# EAGLE design shield (EAGLE 9.6.1)

## Sheet 1 of 2
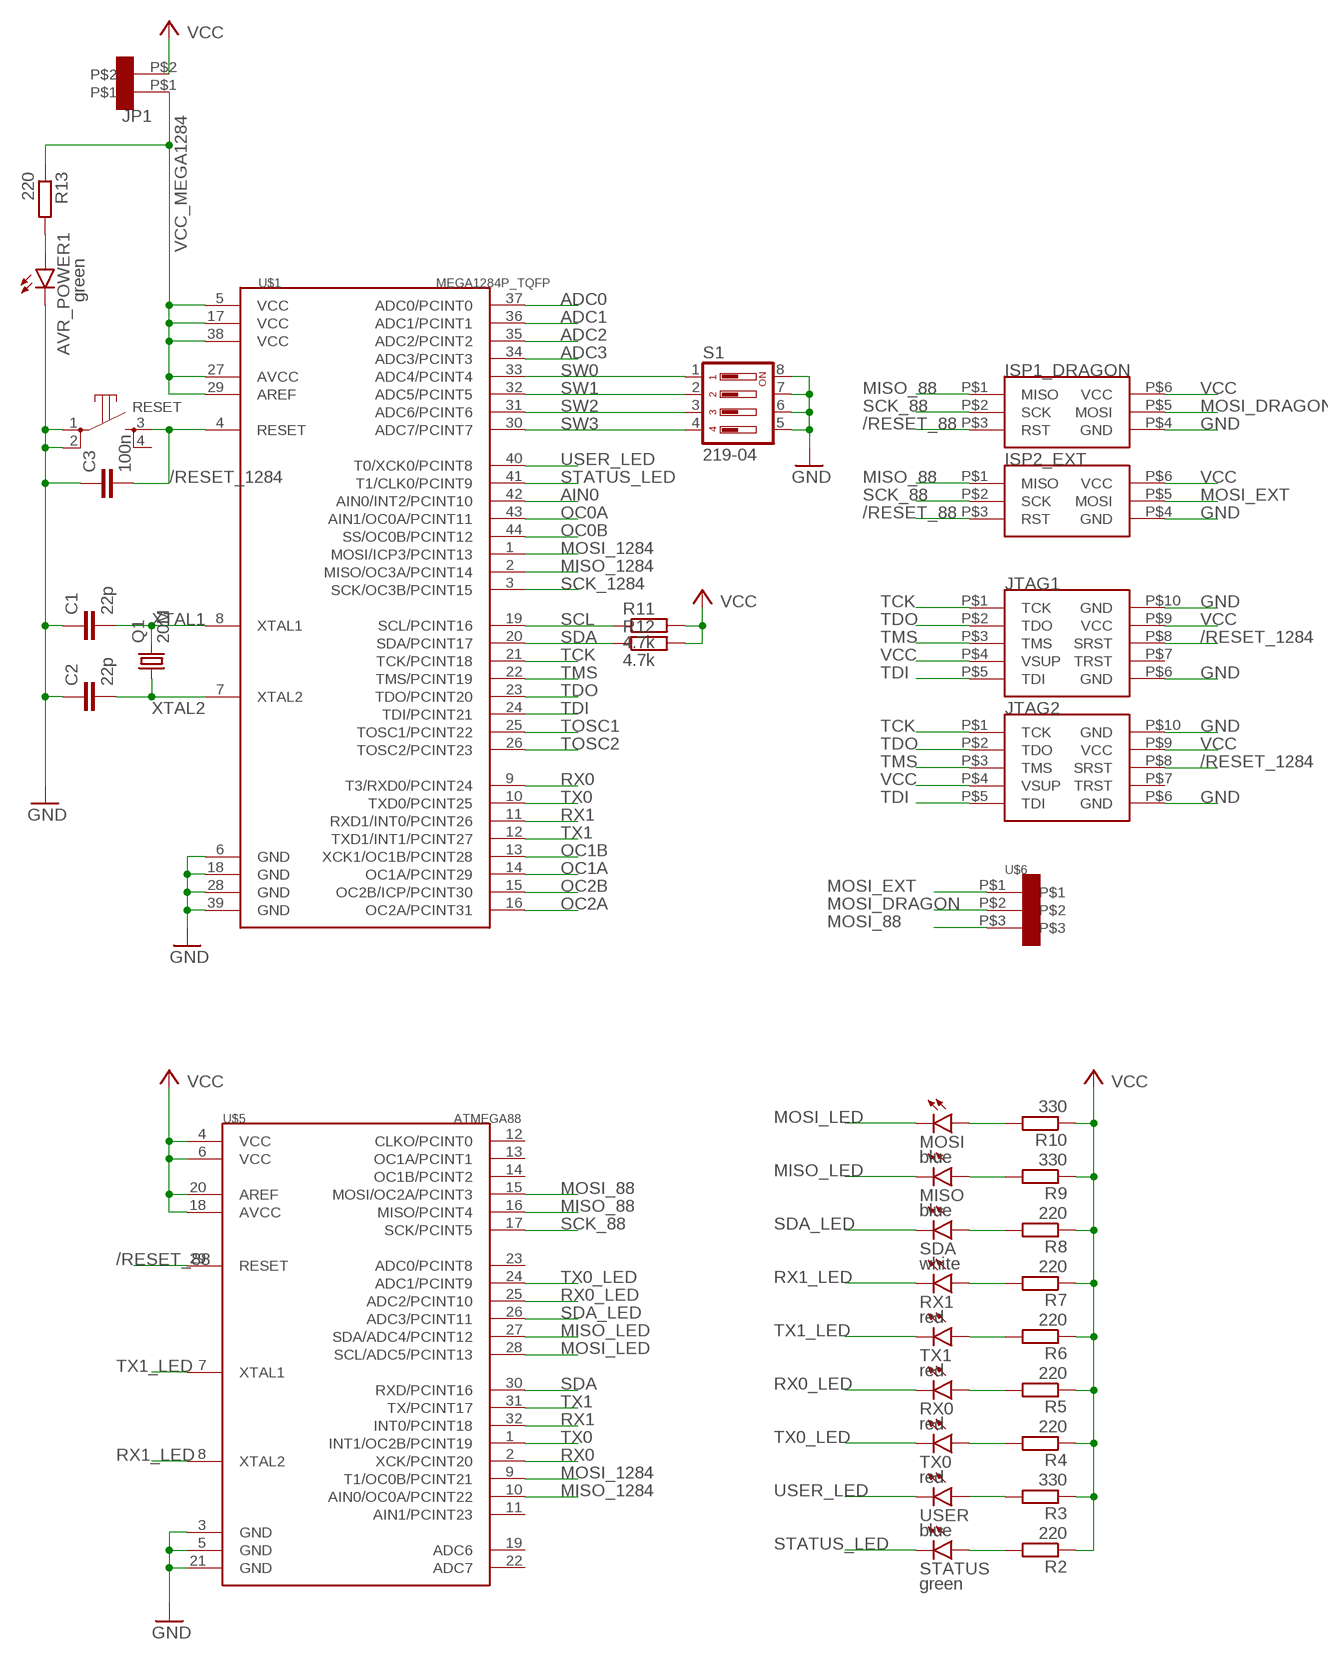
[diagram p0: schematic, sheet 1]

### Parts
AVR_POWER1  green  LEDCHIP-LED0603  [CHIP-LED0603]
C1  22p  C-EUC0603  [C0603]
C2  22p  C-EUC0603  [C0603]
C3  100n  C-EUC0603  [C0603]
ISP1_DRAGON  ISP  [CON_DIL_2X3]
ISP2_EXT  ISP  [CON_DIL_2X3]
JP1  CON_DIL_2  [CON_DIL_2]
JTAG1  JTAG  [CON_DIL_2X5]
JTAG2  JTAG  [CON_DIL_2X5]
MISO  blue  LEDCHIP-LED0603  [CHIP-LED0603]
MOSI  blue  LEDCHIP-LED0603  [CHIP-LED0603]
Q1  20M  CRYSTALHC49U-V  [HC49U-V]
R2  220  R-EU_R0603  [R0603]
R3  330  R-EU_R0603  [R0603]
R4  220  R-EU_R0603  [R0603]
R5  220  R-EU_R0603  [R0603]
R6  220  R-EU_R0603  [R0603]
R7  220  R-EU_R0603  [R0603]
R8  220  R-EU_R0603  [R0603]
R9  330  R-EU_R0603  [R0603]
R10  330  R-EU_R0603  [R0603]
R11  4.7k  R-EU_R0603  [R0603]
R12  4.7k  R-EU_R0603  [R0603]
R13  220  R-EU_R0603  [R0603]
RESET  4-1437565-2  [B3S-10XX]
RX0  red  LEDCHIP-LED0603  [CHIP-LED0603]
RX1  red  LEDCHIP-LED0603  [CHIP-LED0603]
S1  219-04  [CTS-219-04]
SDA  white  LEDCHIP-LED0603  [CHIP-LED0603]
STATUS  green  LEDCHIP-LED0603  [CHIP-LED0603]
TX0  red  LEDCHIP-LED0603  [CHIP-LED0603]
TX1  red  LEDCHIP-LED0603  [CHIP-LED0603]
U$1  MEGA1284P_TQFP  [TQFP44]
U$5  ATMEGA88  [TQFP32-08]
U$6  CON_DIL_3  [CON_DIL_3]
USER  blue  LEDCHIP-LED0603  [CHIP-LED0603]

### Nets
/RESET_88: ISP1_DRAGON.P$3(RST) ISP2_EXT.P$3(RST) U$5.29(RESET)
/RESET_1284: C3.2 JTAG1.P$8(SRST) JTAG2.P$8(SRST) RESET.3 U$1.4(RESET) ; also sheet 2
ADC0: U$1.37(ADC0/PCINT0) ; also sheet 2
ADC1: U$1.36(ADC1/PCINT1) ; also sheet 2
ADC2: U$1.35(ADC2/PCINT2) ; also sheet 2
ADC3: U$1.34(ADC3/PCINT3) ; also sheet 2
AIN0: U$1.42(AIN0/INT2/PCINT10) ; also sheet 2
GND: AVR_POWER1.C C1.1 C2.1 C3.1 ISP1_DRAGON.P$4(GND) ISP2_EXT.P$4(GND) JTAG1.P$6(GND) JTAG1.P$10(GND) JTAG2.P$6(GND) JTAG2.P$10(GND) RESET.1 RESET.2 S1.5 S1.6 S1.7 S1.8 U$1.6(GND) U$1.18(GND) U$1.28(GND) U$1.39(GND) U$5.3(GND) U$5.5(GND) U$5.21(GND) ; also sheet 2
MISO_88: ISP1_DRAGON.P$1(MISO) ISP2_EXT.P$1(MISO) U$5.16(MISO/PCINT4)
MISO_1284: U$1.2(MISO/OC3A/PCINT14) U$5.10(AIN0/OC0A/PCINT22) ; also sheet 2
MISO_LED: MISO.C U$5.27(SDA/ADC4/PCINT12)
MOSI_88: U$5.15(MOSI/OC2A/PCINT3) U$6.P$3
MOSI_1284: U$1.1(MOSI/ICP3/PCINT13) U$5.9(T1/OC0B/PCINT21) ; also sheet 2
MOSI_DRAGON: ISP1_DRAGON.P$5(MOSI) U$6.P$2
MOSI_EXT: ISP2_EXT.P$5(MOSI) U$6.P$1
MOSI_LED: MOSI.C U$5.28(SCL/ADC5/PCINT13)
N$2: R2.2 STATUS.A
N$3: R4.2 TX0.A
N$4: R5.2 RX0.A
N$5: R6.2 TX1.A
N$6: R7.2 RX1.A
N$7: R8.2 SDA.A
N$8: R3.2 USER.A
N$14: MISO.A R9.2
N$15: MOSI.A R10.2
N$52: AVR_POWER1.A R13.2
OC0A: U$1.43(AIN1/OC0A/PCINT11) ; also sheet 2
OC0B: U$1.44(SS/OC0B/PCINT12) ; also sheet 2
OC1A: U$1.14(OC1A/PCINT29) ; also sheet 2
OC1B: U$1.13(XCK1/OC1B/PCINT28) ; also sheet 2
OC2A: U$1.16(OC2A/PCINT31) ; also sheet 2
OC2B: U$1.15(OC2B/ICP/PCINT30) ; also sheet 2
RX0: U$1.9(T3/RXD0/PCINT24) U$5.2(XCK/PCINT20) ; also sheet 2
RX0_LED: RX0.C U$5.25(ADC2/PCINT10)
RX1: U$1.11(RXD1/INT0/PCINT26) U$5.32(INT0/PCINT18) ; also sheet 2
RX1_LED: RX1.C U$5.8(XTAL2)
SCK_88: ISP1_DRAGON.P$2(SCK) ISP2_EXT.P$2(SCK) U$5.17(SCK/PCINT5)
SCK_1284: U$1.3(SCK/OC3B/PCINT15) ; also sheet 2
SCL: R11.1 U$1.19(SCL/PCINT16) ; also sheet 2
SDA: R12.1 U$1.20(SDA/PCINT17) U$5.30(RXD/PCINT16) ; also sheet 2
SDA_LED: SDA.C U$5.26(ADC3/PCINT11)
STATUS_LED: STATUS.C U$1.41(T1/CLK0/PCINT9) ; also sheet 2
SW0: S1.1 U$1.33(ADC4/PCINT4) ; also sheet 2
SW1: S1.2 U$1.32(ADC5/PCINT5) ; also sheet 2
SW2: S1.3 U$1.31(ADC6/PCINT6) ; also sheet 2
SW3: S1.4 U$1.30(ADC7/PCINT7) ; also sheet 2
TCK: JTAG1.P$1(TCK) JTAG2.P$1(TCK) U$1.21(TCK/PCINT18) ; also sheet 2
TDI: JTAG1.P$5(TDI) JTAG2.P$5(TDI) U$1.24(TDI/PCINT21) ; also sheet 2
TDO: JTAG1.P$2(TDO) JTAG2.P$2(TDO) U$1.23(TDO/PCINT20) ; also sheet 2
TMS: JTAG1.P$3(TMS) JTAG2.P$3(TMS) U$1.22(TMS/PCINT19) ; also sheet 2
TOSC1: U$1.25(TOSC1/PCINT22) ; also sheet 2
TOSC2: U$1.26(TOSC2/PCINT23) ; also sheet 2
TX0: U$1.10(TXD0/PCINT25) U$5.1(INT1/OC2B/PCINT19) ; also sheet 2
TX0_LED: TX0.C U$5.24(ADC1/PCINT9)
TX1: U$1.12(TXD1/INT1/PCINT27) U$5.31(TX/PCINT17) ; also sheet 2
TX1_LED: TX1.C U$5.7(XTAL1)
USER_LED: U$1.40(T0/XCK0/PCINT8) USER.C ; also sheet 2
VCC: ISP1_DRAGON.P$6(VCC) ISP2_EXT.P$6(VCC) JP1.P$2 JTAG1.P$4(VSUP) JTAG1.P$9(VCC) JTAG2.P$4(VSUP) JTAG2.P$9(VCC) R2.1 R3.1 R4.1 R5.1 R6.1 R7.1 R8.1 R9.1 R10.1 R11.2 R12.2 U$5.4(VCC) U$5.6(VCC) U$5.18(AVCC) U$5.20(AREF) ; also sheet 2
VCC_MEGA1284: JP1.P$1 R13.1 U$1.5(VCC) U$1.17(VCC) U$1.27(AVCC) U$1.29(AREF) U$1.38(VCC) ; also sheet 2
XTAL1: C1.2 Q1.2 U$1.8(XTAL1) ; also sheet 2
XTAL2: C2.2 Q1.1 U$1.7(XTAL2) ; also sheet 2
Unconnected: JTAG1.P$7(TRST) JTAG2.P$7(TRST) RESET.4 U$5.11(AIN1/PCINT23) U$5.12(CLKO/PCINT0) U$5.13(OC1A/PCINT1) U$5.14(OC1B/PCINT2) U$5.19(ADC6) U$5.22(ADC7) U$5.23(ADC0/PCINT8)

## Sheet 2 of 2
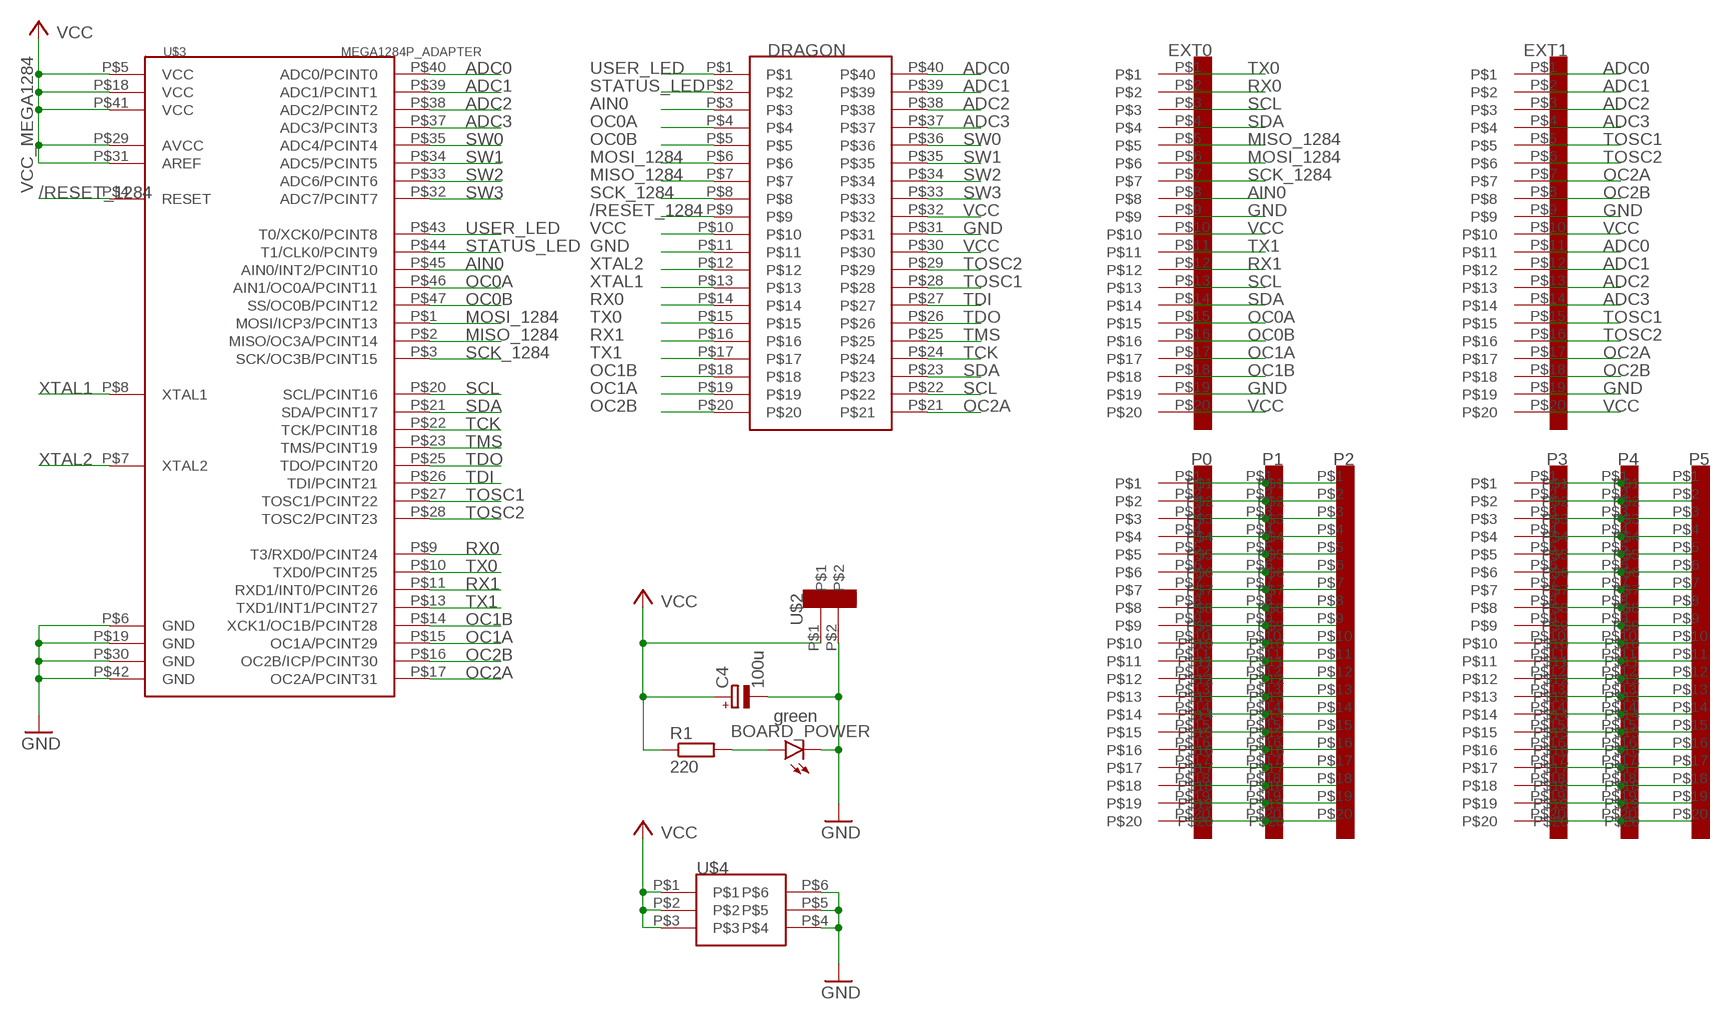
[diagram p1: schematic, sheet 2]

### Parts
BOARD_POWER  green  LEDCHIP-LED0603  [CHIP-LED0603]
C4  100u  CPOL-EUE2.5-5  [E2,5-5]
DRAGON  CON_DIL_2X20  [CON_DIL_2X20]
EXT0  CON_DIL_20  [CON_DIL_20]
EXT1  CON_DIL_20  [CON_DIL_20]
P0  CON_DIL_20  [CON_DIL_20]
P1  CON_DIL_20  [CON_DIL_20]
P2  CON_DIL_20  [CON_DIL_20]
P3  CON_DIL_20  [CON_DIL_20]
P4  CON_DIL_20  [CON_DIL_20]
P5  CON_DIL_20  [CON_DIL_20]
R1  220  R-EU_R0603  [R0603]
U$2  CON_DIL_2  [CON_DIL_2]
U$3  MEGA1284P_ADAPTER  [TQFP44-ADAPTER]
U$4  CON_DIL_2X3  [CON_DIL_2X3]

### Nets
/RESET_1284: DRAGON.P$9 U$3.P$4(RESET) ; also sheet 1
ADC0: DRAGON.P$40 EXT1.P$1 EXT1.P$11 U$3.P$40(ADC0/PCINT0) ; also sheet 1
ADC1: DRAGON.P$39 EXT1.P$2 EXT1.P$12 U$3.P$39(ADC1/PCINT1) ; also sheet 1
ADC2: DRAGON.P$38 EXT1.P$3 EXT1.P$13 U$3.P$38(ADC2/PCINT2) ; also sheet 1
ADC3: DRAGON.P$37 EXT1.P$4 EXT1.P$14 U$3.P$37(ADC3/PCINT3) ; also sheet 1
AIN0: DRAGON.P$3 EXT0.P$8 U$3.P$45(AIN0/INT2/PCINT10) ; also sheet 1
GND: BOARD_POWER.C C4.- DRAGON.P$11 DRAGON.P$31 EXT0.P$9 EXT0.P$19 EXT1.P$9 EXT1.P$19 U$2.P$2 U$3.P$6(GND) U$3.P$19(GND) U$3.P$30(GND) U$3.P$42(GND) U$4.P$4 U$4.P$5 U$4.P$6 ; also sheet 1
MISO_1284: DRAGON.P$7 EXT0.P$5 U$3.P$2(MISO/OC3A/PCINT14) ; also sheet 1
MOSI_1284: DRAGON.P$6 EXT0.P$6 U$3.P$1(MOSI/ICP3/PCINT13) ; also sheet 1
N$1: BOARD_POWER.A R1.2
N$9: P0.P$1 P1.P$1 P2.P$1
N$10: P0.P$2 P1.P$2 P2.P$2
N$11: P0.P$3 P1.P$3 P2.P$3
N$12: P0.P$4 P1.P$4 P2.P$4
N$13: P0.P$5 P1.P$5 P2.P$5
N$16: P0.P$6 P1.P$6 P2.P$6
N$17: P0.P$7 P1.P$7 P2.P$7
N$18: P0.P$8 P1.P$8 P2.P$8
N$19: P0.P$9 P1.P$9 P2.P$9
N$20: P0.P$10 P1.P$10 P2.P$10
N$21: P0.P$11 P1.P$11 P2.P$11
N$22: P0.P$12 P1.P$12 P2.P$12
N$23: P0.P$13 P1.P$13 P2.P$13
N$24: P0.P$14 P1.P$14 P2.P$14
N$25: P0.P$15 P1.P$15 P2.P$15
N$26: P0.P$16 P1.P$16 P2.P$16
N$27: P0.P$17 P1.P$17 P2.P$17
N$28: P0.P$18 P1.P$18 P2.P$18
N$29: P0.P$19 P1.P$19 P2.P$19
N$30: P0.P$20 P1.P$20 P2.P$20
N$31: P3.P$1 P4.P$1 P5.P$1
N$32: P3.P$2 P4.P$2 P5.P$2
N$33: P3.P$3 P4.P$3 P5.P$3
N$34: P3.P$4 P4.P$4 P5.P$4
N$35: P3.P$5 P4.P$5 P5.P$5
N$36: P3.P$6 P4.P$6 P5.P$6
N$37: P3.P$7 P4.P$7 P5.P$7
N$38: P3.P$8 P4.P$8 P5.P$8
N$39: P3.P$9 P4.P$9 P5.P$9
N$40: P3.P$10 P4.P$10 P5.P$10
N$41: P3.P$11 P4.P$11 P5.P$11
N$42: P3.P$12 P4.P$12 P5.P$12
N$43: P3.P$13 P4.P$13 P5.P$13
N$44: P3.P$14 P4.P$14 P5.P$14
N$45: P3.P$15 P4.P$15 P5.P$15
N$46: P3.P$16 P4.P$16 P5.P$16
N$47: P3.P$17 P4.P$17 P5.P$17
N$48: P3.P$18 P4.P$18 P5.P$18
N$49: P3.P$19 P4.P$19 P5.P$19
N$50: P3.P$20 P4.P$20 P5.P$20
OC0A: DRAGON.P$4 EXT0.P$15 U$3.P$46(AIN1/OC0A/PCINT11) ; also sheet 1
OC0B: DRAGON.P$5 EXT0.P$16 U$3.P$47(SS/OC0B/PCINT12) ; also sheet 1
OC1A: DRAGON.P$19 EXT0.P$17 U$3.P$15(OC1A/PCINT29) ; also sheet 1
OC1B: DRAGON.P$18 EXT0.P$18 U$3.P$14(XCK1/OC1B/PCINT28) ; also sheet 1
OC2A: DRAGON.P$21 EXT1.P$7 EXT1.P$17 U$3.P$17(OC2A/PCINT31) ; also sheet 1
OC2B: DRAGON.P$20 EXT1.P$8 EXT1.P$18 U$3.P$16(OC2B/ICP/PCINT30) ; also sheet 1
RX0: DRAGON.P$14 EXT0.P$2 U$3.P$9(T3/RXD0/PCINT24) ; also sheet 1
RX1: DRAGON.P$16 EXT0.P$12 U$3.P$11(RXD1/INT0/PCINT26) ; also sheet 1
SCK_1284: DRAGON.P$8 EXT0.P$7 U$3.P$3(SCK/OC3B/PCINT15) ; also sheet 1
SCL: DRAGON.P$22 EXT0.P$3 EXT0.P$13 U$3.P$20(SCL/PCINT16) ; also sheet 1
SDA: DRAGON.P$23 EXT0.P$4 EXT0.P$14 U$3.P$21(SDA/PCINT17) ; also sheet 1
STATUS_LED: DRAGON.P$2 U$3.P$44(T1/CLK0/PCINT9) ; also sheet 1
SW0: DRAGON.P$36 U$3.P$35(ADC4/PCINT4) ; also sheet 1
SW1: DRAGON.P$35 U$3.P$34(ADC5/PCINT5) ; also sheet 1
SW2: DRAGON.P$34 U$3.P$33(ADC6/PCINT6) ; also sheet 1
SW3: DRAGON.P$33 U$3.P$32(ADC7/PCINT7) ; also sheet 1
TCK: DRAGON.P$24 U$3.P$22(TCK/PCINT18) ; also sheet 1
TDI: DRAGON.P$27 U$3.P$26(TDI/PCINT21) ; also sheet 1
TDO: DRAGON.P$26 U$3.P$25(TDO/PCINT20) ; also sheet 1
TMS: DRAGON.P$25 U$3.P$23(TMS/PCINT19) ; also sheet 1
TOSC1: DRAGON.P$28 EXT1.P$5 EXT1.P$15 U$3.P$27(TOSC1/PCINT22) ; also sheet 1
TOSC2: DRAGON.P$29 EXT1.P$6 EXT1.P$16 U$3.P$28(TOSC2/PCINT23) ; also sheet 1
TX0: DRAGON.P$15 EXT0.P$1 U$3.P$10(TXD0/PCINT25) ; also sheet 1
TX1: DRAGON.P$17 EXT0.P$11 U$3.P$13(TXD1/INT1/PCINT27) ; also sheet 1
USER_LED: DRAGON.P$1 U$3.P$43(T0/XCK0/PCINT8) ; also sheet 1
VCC: C4.+ DRAGON.P$10 DRAGON.P$30 DRAGON.P$32 EXT0.P$10 EXT0.P$20 EXT1.P$10 EXT1.P$20 R1.1 U$2.P$1 U$4.P$1 U$4.P$2 U$4.P$3 ; also sheet 1
VCC_MEGA1284: U$3.P$5(VCC) U$3.P$18(VCC) U$3.P$29(AVCC) U$3.P$31(AREF) U$3.P$41(VCC) ; supply symbol labelled VCC ; also sheet 1
XTAL1: DRAGON.P$13 U$3.P$8(XTAL1) ; also sheet 1
XTAL2: DRAGON.P$12 U$3.P$7(XTAL2) ; also sheet 1

## Library data of the parts
AVR_POWER1 BOARD_POWER MISO MOSI RX0 RX1 SDA STATUS TX0 TX1 USER = led:LED: LED OSRAM: - CHIPLED LG R971, LG N971, LY N971, LG Q971, LY Q971, LO R971, LY R971 LH N974, LH R974 LS Q976, LO Q976, LY Q976 LO Q996 - Hyper CHIPLED LW Q18S LB Q993, LB Q99A, LB R99A - SideLED LS A670, LO A670, LY A670, LG A670, LP A670 LB A673, LV A673, LT A673, LW A673 LH A674 LY A675 LS A676, LA A676, LO A676, LY A676, LW A676 LS A679, LY A679, LG A679 - Hyper Micro SIDELED® LS Y876, LA Y876, LO Y876, LY Y876 LT Y87S - SmartLED LW L88C, LW L88S LB L89C, LB L89S, LG L890 LS L89K, LO L89K, LY L89K LS L896, LA L896, LO L896, LY L896 - TOPLED LS T670, LO T670, LY T670, LG T670, LP T670 LSG T670, LSP T670, LSY T670, LOP T670, LYG T670 LG T671, LOG T671, LSG T671 LB T673, LV T673, LT T673, LW T673 LH T674 LS T676, LA T676, LO T676, LY T676, LB T676, LH T676, LSB T676, LW T676 LB T67C, LV T67C, LT T67C, LS T67K, LO T67K, LY T67K, LW E67C LS E67B, LA E67B, LO E67B, LY E67B, LB E67C, LV E67C, LT E67C LW T67C LS T679, LY T679, LG T679 LS T770, LO T770, LY T770, LG T770, LP T770 LB T773, LV T773, LT T773, LW T773 LH T774 LS E675, LA E675, LY E675, LS T675 LS T776, LA T776, LO T776, LY T776, LB T776 LHGB T686 LT T68C, LB T68C - Hyper Mini TOPLED® LB M676 - Mini TOPLED Santana® LG M470 LS M47K, LO M47K, LY M47K Source: http://www.osram.convergy.de LUXEON: - LUMILED® LXK2-PW12-R00, LXK2-PW12-S00, LXK2-PW14-U00, LXK2-PW14-V00 LXK2-PM12-R00, LXK2-PM12-S00, LXK2-PM14-U00 LXK2-PE12-Q00, LXK2-PE12-R00, LXK2-PE12-S00, LXK2-PE14-T00, LXK2-PE14-U00 LXK2-PB12-K00, LXK2-PB12-L00, LXK2-PB12-M00, LXK2-PB14-N00, LXK2-PB14-P00, LXK2-PB14-Q00 LXK2-PR12-L00, LXK2-PR12-M00, LXK2-PR14-Q00, LXK2-PR14-R00 LXK2-PD12-Q00, LXK2-PD12-R00, LXK2-PD12-S00 LXK2-PH12-R00, LXK2-PH12-S00 LXK2-PL12-P00, LXK2-PL12-Q00, LXK2-PL12-R00 Source: www.luxeon.com KINGBRIGHT: KA-3528ASYC Source: www.kingbright.com
C1-C3 = rcl:C-EU: CAPACITOR, European symbol; SPICEPREFIX: C
C4 = rcl:CPOL-EU: POLARIZED CAPACITOR, European symbol; SPICEPREFIX: C
DRAGON = connector:CON_DIL_2X20
EXT0 EXT1 P0 P1-P5 = connector:CON_DIL_20
ISP1_DRAGON ISP2_EXT = connector:ISP
JP1 U$2 = connector:CON_DIL_2
JTAG1 JTAG2 = connector:JTAG
Q1 = crystal:CRYSTAL: CRYSTAL; OC_FARNELL: 1666969; OC_NEWARK: unknown
R1-R13 = rcl:R-EU_: RESISTOR, European symbol; SPICEPREFIX: R
RESET = switch:4-1437565-2: SMD Tactile Switch Manufacturer TE CONNECTIVITY
S1 = switch-dil:219-04*: Surface Mount DIP Switch Series 219 SMT CTS Electronic Components Sourc: www.ctscorp.com; OC_FARNELL: unknown; OC_NEWARK: unknown
U$1 = 1284p.rpt:MEGA1284P_TQFP
U$3 = mega1284p:MEGA1284P_ADAPTER
U$4 = connector:CON_DIL_2X3
U$5 = mega88:ATMEGA88
U$6 = connector:CON_DIL_3

## Board
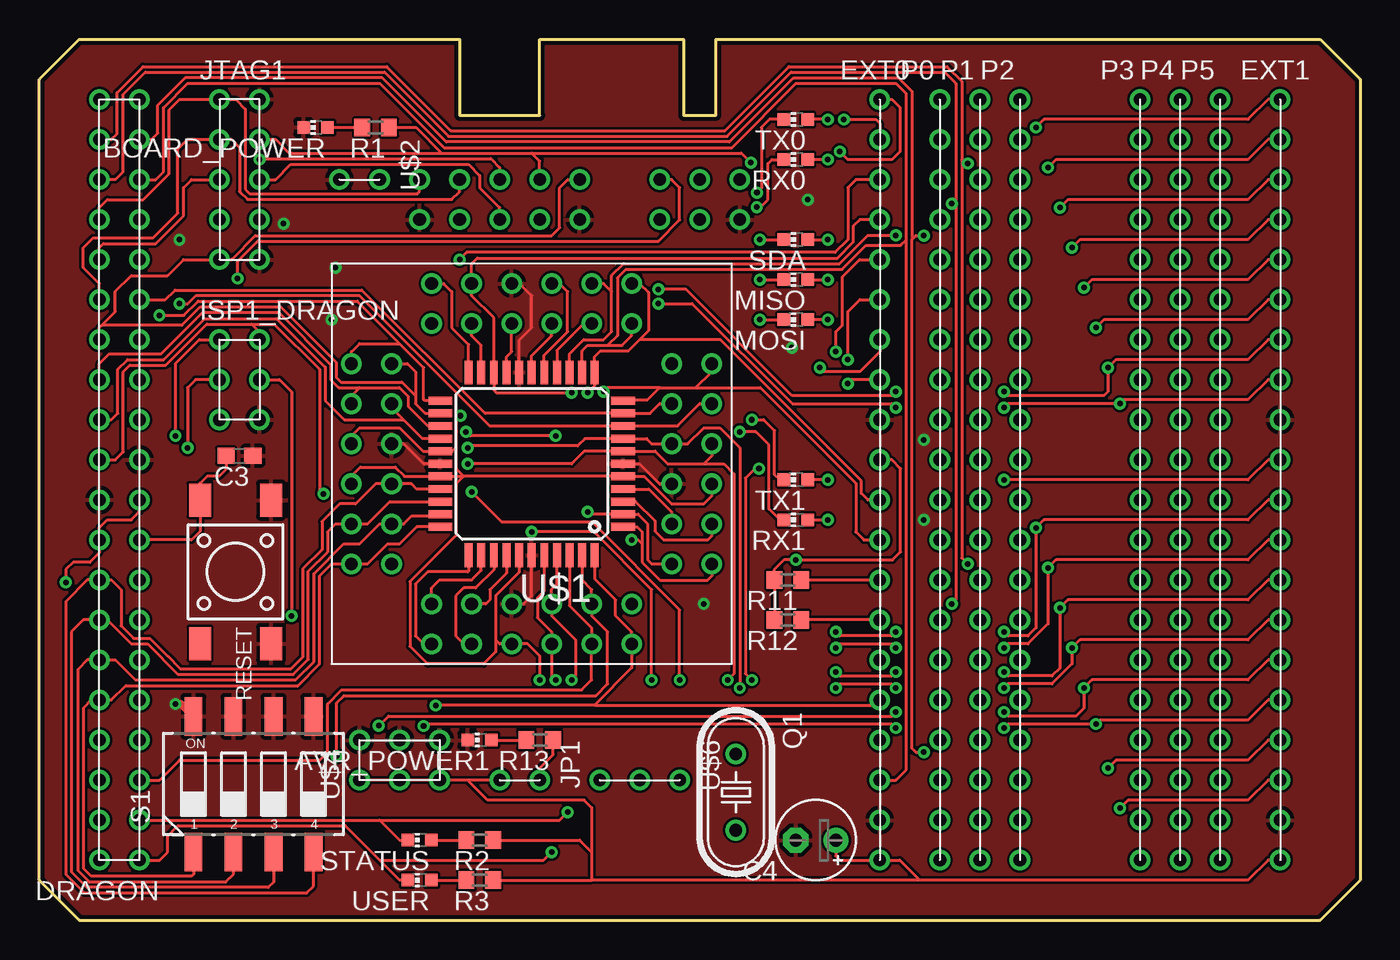
[diagram p2: board, top side]
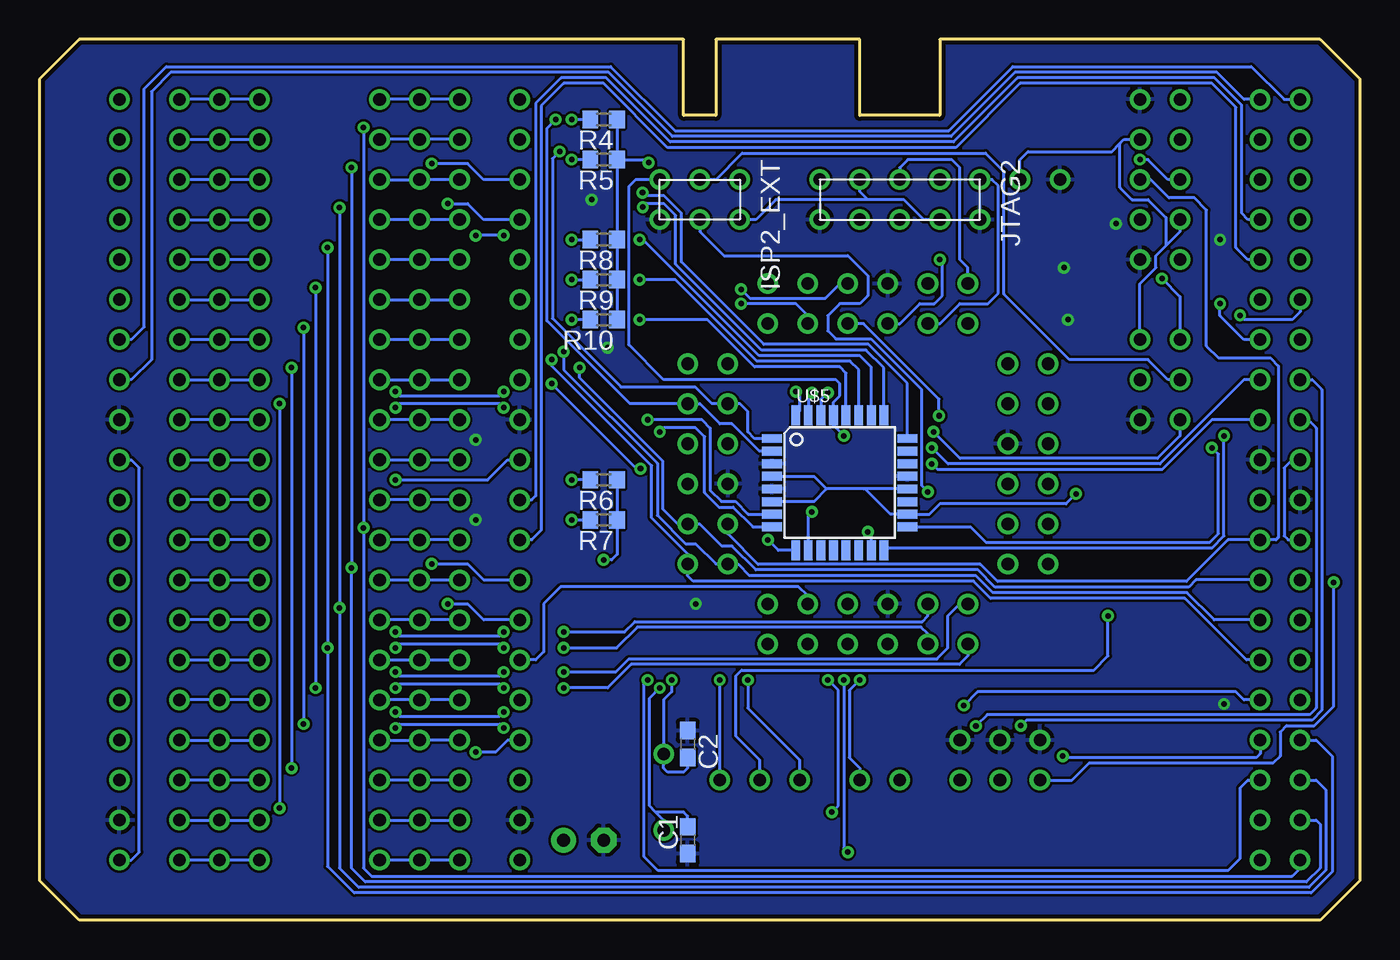
[diagram p3: board, bottom side, seen from below]

Size 83.82 x 55.88 mm. Coordinates in mm from the lower left corner, seen from the top.
Outline: 2.54,0 81.28,0 83.82,2.54 83.82,53.34 81.28,55.88 42.93,55.88 42.93,51.05 40.89,51.05 40.89,55.88 31.75,55.88 31.75,51.05 26.67,51.05 26.67,55.88 2.54,55.88 0,53.34 0,2.54 2.54,0
Copper layers (1*16): Top 0.035mm / dielectric 1.5mm / Bottom 0.035mm
Design rules "default *": minimum track width 6mil, minimum drill 0.35mm, track to track 6mil, track to pad 6mil, pad to pad 6mil, via to via 6mil, smd to smd 6mil, copper to edge 10mil, drill to drill 6mil, minimum pad ring 10mil, minimum via ring 8mil, stop-mask expansion 4mil, vias tented up to drill 0mil, thermal gap 10mil

### Footprints (pad centres in the part's own frame; a part is rotated, then mirrored left to right if it is on the bottom)
CHIP-LED0603 = smd 0.8 x 0.8: A 0,-0.75; C 0,0.75
C0603 = smd 1.1 x 1: 1 -0.85,0; 2 0.85,0
E2,5-5 = drill 0.813 pad 1.6: + -1.27,0 | drill 0.813 pad 1.6 octagon: - 1.27,0
CON_DIL_2X20 = drill 0.8: P$1 -1.27,24.13; P$2 -1.27,21.59; P$3 -1.27,19.05; P$4 -1.27,16.51; P$5 -1.27,13.97; P$6 -1.27,11.43; P$7 -1.27,8.89; P$8 -1.27,6.35; P$9 -1.27,3.81; P$10 -1.27,1.27; P$11 -1.27,-1.27; P$12 -1.27,-3.81; P$13 -1.27,-6.35; P$14 -1.27,-8.89; P$15 -1.27,-11.43; P$16 -1.27,-13.97; P$17 -1.27,-16.51; P$18 -1.27,-19.05; P$19 -1.27,-21.59; P$20 -1.27,-24.13; P$21 1.27,-24.13; P$22 1.27,-21.59; P$23 1.27,-19.05; P$24 1.27,-16.51; P$25 1.27,-13.97; P$26 1.27,-11.43; P$27 1.27,-8.89; P$28 1.27,-6.35; P$29 1.27,-3.81; P$30 1.27,-1.27; P$31 1.27,1.27; P$32 1.27,3.81; P$33 1.27,6.35; P$34 1.27,8.89; P$35 1.27,11.43; P$36 1.27,13.97; P$37 1.27,16.51; P$38 1.27,19.05; P$39 1.27,21.59; P$40 1.27,24.13
CON_DIL_20 = drill 0.8: P$1 -2.54,5.08; P$2 -2.54,2.54; P$3 -2.54,0; P$4 -2.54,-2.54; P$5 -2.54,-5.08; P$6 -2.54,-7.62; P$7 -2.54,-10.16; P$8 -2.54,-12.7; P$9 -2.54,-15.24; P$10 -2.54,-17.78; P$11 -2.54,-20.32; P$12 -2.54,-22.86; P$13 -2.54,-25.4; P$14 -2.54,-27.94; P$15 -2.54,-30.48; P$16 -2.54,-33.02; P$17 -2.54,-35.56; P$18 -2.54,-38.1; P$19 -2.54,-40.64; P$20 -2.54,-43.18
CON_DIL_2X3 = drill 0.8: P$1 -1.27,2.54; P$2 -1.27,0; P$3 -1.27,-2.54; P$4 1.27,-2.54; P$5 1.27,0; P$6 1.27,2.54
CON_DIL_2 = drill 0.8: P$1 0,2.54; P$2 0,0
CON_DIL_2X5 = drill 0.8: P$1 -1.27,5.08; P$2 -1.27,2.54; P$3 -1.27,0; P$4 -1.27,-2.54; P$5 -1.27,-5.08; P$6 1.27,-5.08; P$7 1.27,-2.54; P$8 1.27,0; P$9 1.27,2.54; P$10 1.27,5.08
HC49U-V = drill 0.813: 1 -2.413,0; 2 2.413,0
R0603 = smd 1 x 1.1: 1 -0.85,0; 2 0.85,0
B3S-10XX = smd 2.1 x 1.4: 1 -4.55,2.25; 2 4.55,2.25; 3 -4.55,-2.25; 4 4.55,-2.25
CTS-219-04 = smd 1.13 x 2.44: 1 -3.81,-4.3; 2 -1.27,-4.3; 3 1.27,-4.3; 4 3.81,-4.3; 5 3.81,4.3; 6 1.27,4.3; 7 -1.27,4.3; 8 -3.81,4.3
TQFP44 = smd 1.5 x 0.5: 1 -5.8,4; 2 -5.8,3.2; 3 -5.8,2.4; 4 -5.8,1.6; 5 -5.8,0.8; 6 -5.8,0; 7 -5.8,-0.8; 8 -5.8,-1.6; 9 -5.8,-2.4; 10 -5.8,-3.2; 11 -5.8,-4; 23 5.8,-4; 24 5.8,-3.2; 25 5.8,-2.4; 26 5.8,-1.6; 27 5.8,-0.8; 28 5.8,0; 29 5.8,0.8; 30 5.8,1.6; 31 5.8,2.4; 32 5.8,3.2; 33 5.8,4 | smd 0.5 x 1.5: 12 -4,-5.8; 13 -3.2,-5.8; 14 -2.4,-5.8; 15 -1.6,-5.8; 16 -0.8,-5.8; 17 0,-5.8; 18 0.8,-5.8; 19 1.6,-5.8; 20 2.4,-5.8; 21 3.2,-5.8; 22 4,-5.8; 34 4,5.8; 35 3.2,5.8; 36 2.4,5.8; 37 1.6,5.8; 38 0.8,5.8; 39 0,5.8; 40 -0.8,5.8; 41 -1.6,5.8; 42 -2.4,5.8; 43 -3.2,5.8; 44 -4,5.8
TQFP44-ADAPTER = drill 0.8: P$1 -6.35,2.54; P$2 -3.81,2.54; P$3 -6.35,0; P$4 -3.81,0; P$5 -6.35,-2.54; P$6 -3.81,-2.54; P$7 -6.35,-5.08; P$8 -3.81,-5.08; P$9 -6.35,-7.62; P$10 -3.81,-7.62; P$11 -6.35,-10.16; P$12 -3.81,-10.16; P$13 -1.27,-15.24; P$14 -1.27,-12.7; P$15 1.27,-15.24; P$16 1.27,-12.7; P$17 3.81,-15.24; P$18 3.81,-12.7; P$19 6.35,-15.24; P$20 6.35,-12.7; P$21 8.89,-15.24; P$22 8.89,-12.7; P$23 11.43,-15.24; P$24 11.43,-12.7; P$25 16.51,-10.16; P$26 13.97,-10.16; P$27 16.51,-7.62; P$28 13.97,-7.62; P$29 16.51,-5.08; P$30 13.97,-5.08; P$31 16.51,-2.54; P$32 13.97,-2.54; P$33 16.51,0; P$34 13.97,0; P$35 16.51,2.54; P$36 13.97,2.54; P$37 11.43,7.62; P$38 11.43,5.08; P$39 8.89,7.62; P$40 8.89,5.08; P$41 6.35,7.62; P$42 6.35,5.08; P$43 3.81,7.62; P$44 3.81,5.08; P$45 1.27,7.62; P$46 1.27,5.08; P$47 -1.27,7.62; P$48 -1.27,5.08
TQFP32-08 = smd 1.27 x 0.559: 1 -4.293,2.8; 2 -4.293,2; 3 -4.293,1.2; 4 -4.293,0.4; 5 -4.293,-0.4; 6 -4.293,-1.2; 7 -4.293,-2; 8 -4.293,-2.8; 17 4.293,-2.8; 18 4.293,-2; 19 4.293,-1.2; 20 4.293,-0.4; 21 4.293,0.4; 22 4.293,1.2; 23 4.293,2; 24 4.293,2.8 | smd 0.559 x 1.27: 9 -2.8,-4.293; 10 -2,-4.293; 11 -1.2,-4.293; 12 -0.4,-4.293; 13 0.4,-4.293; 14 1.2,-4.293; 15 2,-4.293; 16 2.8,-4.293; 25 2.8,4.293; 26 2,4.293; 27 1.2,4.293; 28 0.4,4.293; 29 -0.4,4.293; 30 -1.2,4.293; 31 -2,4.293; 32 -2.8,4.293
CON_DIL_3 = drill 0.8: P$1 0,2.54; P$2 0,0; P$3 0,-2.54

### Placement (x,y rotation side)
AVR_POWER1  27.94,11.43 90 top
BOARD_POWER  17.53,50.29 90 top
C1  42.67,5.08 90 bottom
C2  42.67,11.18 270 bottom
C3  12.7,29.46 180 top
C4  49.28,5.08 180 top
DRAGON  5.08,27.94 180 top
EXT0  55.88,46.99 0 top
EXT1  81.28,46.99 0 top
ISP1_DRAGON  12.7,34.29 0 top
ISP2_EXT  41.91,45.72 270 bottom
JP1  29.21,8.89 270 top
JTAG1  12.7,46.99 0 top
JTAG2  29.21,45.72 270 bottom
MISO  48.01,40.64 90 top
MOSI  48.01,38.1 90 top
P0  59.69,46.99 0 top
P1  62.23,46.99 0 top
P2  64.77,46.99 0 top
P3  72.39,46.99 0 top
P4  74.93,46.99 0 top
P5  77.47,46.99 0 top
Q1  44.2,8.13 270 top
R1  21.34,50.29 180 top
R2  27.94,5.08 180 top
R3  27.94,2.54 180 top
R4  48.01,50.8 180 bottom
R5  48.01,48.26 180 bottom
R6  48.01,27.94 180 bottom
R7  48.01,25.4 180 bottom
R8  48.01,43.18 180 bottom
R9  48.01,40.64 180 bottom
R10  48.01,38.1 180 bottom
R11  47.5,21.59 180 top
R12  47.5,19.05 180 top
R13  31.75,11.43 180 top
RESET  12.45,22.1 270 top
RX0  48.01,48.26 90 top
RX1  48.01,25.4 90 top
S1  13.59,8.64 0 top
SDA  48.01,43.18 90 top
STATUS  24.13,5.08 90 top
TX0  48.01,50.8 90 top
TX1  48.01,27.94 90 top
U$1  31.24,28.96 180 top
U$2  19.05,46.99 270 top
U$3  36.32,25.15 180 top
U$4  22.86,10.16 90 top
U$5  33.02,27.76 0 bottom
U$6  38.1,8.89 270 top
USER  24.13,2.54 90 top

### Tracks (layer width: path | path; a pad name or v marks a point on that pad's centre or on a via)
/RESET_88  (via drill 0.35)
  Top 0.203: v32.77,30.72 27.34,30.72 v27.08,30.99
  Bottom 0.203: ISP1_DRAGON.P$3 11.43,30.73 12.86,29.3 25.39,29.3 v27.08,30.99 | v32.77,30.72 32.77,30.73 33.42,31.39 U$5.29 33.42,32.87 33.02,33.27 33.02,34.04 33.27,34.29 44.2,34.29 46.4,36.5 46.4,46.56 45.97,46.99 ISP2_EXT.P$3
/RESET_1284
  Top 0.203: C3.2 11.85,28.61 11.43,28.19 10.67,28.19 10.2,27.72 RESET.3 10.2,24.67 9.65,24.13 DRAGON.P$9 | JTAG2.P$8 29.21,45.21 27.94,46.48 27.94,47.24 27.23,47.95 15.95,47.95 14.99,46.99 JTAG1.P$8 | U$3.P$4 40.13,25.9 38.67,27.36 U$1.4
  Bottom 0.203: JTAG1.P$8 13.29,46.99 12.13,45.82 10.52,45.82 9.75,45.05 9.75,36.42 9,35.67 5.7,35.67 5.18,35.15 5.18,24.28 5.33,24.13 DRAGON.P$9 8.38,24.13 11.02,21.49 23.02,21.49 24.1,22.58 38.2,22.58 40.13,24.51 U$3.P$4
ADC0  (via drill 0.35)
  Top 0.203: EXT1.P$11 77.98,26.67 76.71,25.4 63.75,25.4 v63.25,24.89 63.25,18.54 62.74,18.03 61.47,18.03 v61.21,18.29 | EXT1.P$1 77.98,52.07 76.71,50.8 63.75,50.8 v63.25,50.29 | v50.55,18.29 50.8,18.03 54.1,18.03 v54.36,18.29 | U$1.37 29.64,22.02 28.6,20.98 28.6,20.32 28.35,20.07 U$3.P$40
  Bottom 0.203: DRAGON.P$40 3.81,3.3 4.32,2.79 62.74,2.79 63.25,3.3 v63.25,24.89 v63.25,50.29 | U$3.P$40 27.43,19.3 27.79,18.94 46.02,18.94 46.67,18.29 v50.55,18.29 | v54.36,18.29 54.61,18.03 60.96,18.03 v61.21,18.29
ADC1  (via drill 0.35)
  Top 0.203: U$1.36 28.84,22.24 27.69,21.08 26.92,21.08 26.42,20.57 26.42,18.03 26.92,17.53 U$3.P$39 | EXT1.P$12 77.98,24.13 76.71,22.86 64.52,22.86 v64.01,22.35 64.01,18.8 62.74,17.53 61.47,17.53 v61.21,17.27 | EXT1.P$2 77.98,49.53 76.71,48.26 64.52,48.26 v64.01,47.75 | v50.55,17.27 50.8,17.53 54.1,17.53 v54.36,17.27
  Bottom 0.203: v64.01,47.75 v64.01,22.35 64.01,3.3 63.14,2.44 3.4,2.44 2.54,3.3 2.54,6.1 2.79,6.35 DRAGON.P$39 | U$3.P$39 27.43,18.16 27.86,18.59 45.87,18.59 47.19,17.27 v50.55,17.27 | v54.36,17.27 54.61,17.53 60.96,17.53 v61.21,17.27
ADC2  (via drill 0.35)
  Top 0.203: U$3.P$38 24.89,21.08 25.4,21.59 27.43,21.59 28.04,22.2 U$1.35 | EXT1.P$13 77.98,21.59 76.71,20.32 65.28,20.32 v64.77,19.81 64.77,16 64.27,15.49 61.47,15.49 v61.21,15.75 | EXT1.P$3 77.98,46.99 76.71,45.72 65.28,45.72 v64.77,45.21 | v50.55,15.75 50.8,15.49 54.1,15.49 v54.36,15.75
  Bottom 0.203: v64.77,45.21 v64.77,19.81 64.77,3.3 63.55,2.08 3.26,2.08 2.18,3.16 2.18,8.28 2.79,8.89 DRAGON.P$38 | v54.36,15.75 54.61,15.49 60.96,15.49 v61.21,15.75 | v50.55,15.75 47.24,15.75 46.4,16.58 26.85,16.58 26.16,17.27 26.16,19.3 25.4,20.07 U$3.P$38
ADC3  (via drill 0.35)
  Top 0.203: U$1.34 27.24,22.16 27.18,22.1 24.64,22.1 23.88,21.34 23.88,18.03 24.38,17.53 U$3.P$37 | EXT1.P$4 77.98,44.45 76.71,43.18 66.04,43.18 v65.53,42.67 | EXT1.P$14 77.98,19.05 76.71,17.78 66.04,17.78 v65.53,17.27 65.53,16.26 64.26,14.99 61.47,14.99 v61.21,14.73 | v50.55,14.73 50.8,14.99 54.1,14.99 v54.36,14.73
  Bottom 0.203: v65.53,42.67 v65.53,17.27 65.53,3.42 63.84,1.73 3.11,1.73 1.78,3.06 1.78,10.41 2.79,11.43 DRAGON.P$37 | v50.55,14.73 47.75,14.73 46.26,16.23 25.43,16.23 24.89,16.76 U$3.P$37 | v54.36,14.73 54.61,14.99 60.96,14.99 v61.21,14.73
AIN0  (via drill 0.35)
  Top 0.203: v51.31,34.04 51.56,34.29 EXT0.P$8 | DRAGON.P$3 7.62,8.89 8.89,10.16 17.78,10.16 18.29,10.67 18.29,13.72 19.18,14.61 34.42,14.61 35.05,15.24 U$3.P$45 35.05,18.54 33.64,19.95 U$1.42 | v45.21,15.24 44.81,15.65 44.81,28.04 45.41,28.65 v45.67,28.65
  Bottom 0.203: v51.31,34.04 45.92,28.65 v45.67,28.65 | DRAGON.P$3 7.11,8.89 7.62,8.38 7.62,3.91 8.38,3.15 44.55,3.15 45.47,4.06 45.47,14.99 v45.21,15.24
GND  (via drill 0.35)
  Top 0.203: U$1.18 30.44,36.79 31.24,37.59 31.24,39.62 30.48,40.39 U$3.P$19 | v8.64,13.72 8.65,13.7 | U$3.P$42 30.73,20.07 31.24,20.57 U$1.39 | U$3.P$6 39.37,27.69 38.1,28.96 U$1.6 | U$3.P$30 23.11,30.23 24.38,28.96 U$1.28
  Top 0.508: 8.65,13.7 9.02,13.7 S1.8
  other vias: 8.89,43.18 15.49,44.2 56.13,30.48 56.13,25.4 18.8,41.4 18.54,38.1 48.77,45.72 42.16,20.07 47.75,36.32
  pour Bottom: 0.25,55.63 83.57,55.63 83.57,0.25 0.25,0.25
  pour Top: 0,55.88 83.82,55.88 83.82,0 0,0
MISO_88  (via drill 0.35)
  Top 0.203: ISP2_EXT.P$1 40.13,46.99 40.64,46.48 40.64,44.44 39.28,43.08 13.85,43.08 12.58,41.8 v12.58,40.71 | v8.64,30.73 8.64,35.32 10.15,36.84 ISP1_DRAGON.P$1
  Bottom 0.203: v12.58,40.71 11.43,39.57 ISP1_DRAGON.P$1 | U$5.16 30.07,23.62 9.39,23.62 8.64,24.38 v8.64,30.73
MISO_1284  (via drill 0.35)
  Top 0.203: U$3.P$2 38.86,22.61 38.61,22.86 38.61,25.15 38,25.76 U$1.2 34.95,25.76 v34.8,25.91 | v50.55,36.07 50.55,37.34 50.95,37.74 50.95,40.81 52.05,41.91 EXT0.P$5
  Bottom 0.203: v50.55,36.07 50.55,34.92 44.6,28.98 44.6,25.68 42.8,23.88 42.16,23.88 40.89,22.61 U$3.P$2 39.49,22.61 38.75,21.86 24.39,21.86 23.31,20.78 10.99,20.78 9.26,19.05 DRAGON.P$7 | U$5.10 35.02,25.68 v34.8,25.91
MISO_LED  (via drill 0.35)
  Top 0.203: v45.72,40.64 MISO.C
  Bottom 0.203: U$5.27 31.82,34.92 32.36,35.46 38.28,35.46 43.46,40.64 v45.72,40.64
MOSI_88  (via drill 0.35)
  Top 0.203: v38.86,15.24 38.86,20.97 35.19,24.64 v31.24,24.64
  Bottom 0.203: U$5.15 31.02,24.42 v31.24,24.64 | v38.86,15.24 38.86,13.46 35.56,10.16 U$6.P$3
MOSI_1284  (via drill 0.35)
  Top 0.203: 38.25,23.88 38.25,24.64 37.93,24.96 U$1.1 | 38.25,23.88 38.25,22.71 39.42,21.54 42.37,21.54 42.67,21.84 U$3.P$1 | EXT0.P$6 52.07,39.37 51.31,38.61 v51.31,35.56 | v37.59,24.13 38,24.13 38.25,23.88
  Bottom 0.203: U$5.9 36.93,23.47 v37.59,24.13 | DRAGON.P$6 7.22,16.51 11.13,20.42 23.45,20.42 24.54,21.51 42.34,21.51 42.67,21.84 U$3.P$1 42.67,23.25 44.96,25.53 44.96,28.83 51.31,35.18 v51.31,35.56
MOSI_DRAGON  (via drill 0.35)
  Top 0.203: v16,19.3 16,33.53 15.24,34.29 ISP1_DRAGON.P$5
  Bottom 0.203: v16,19.3 16,16.76 16.89,15.87 39.25,15.87 39.62,15.49 39.62,11.68 38.1,10.16 U$6.P$2
MOSI_EXT  (via drill 0.35)
  Top 0.203: v27.43,27.18 29.34,25.27 35.06,25.27 40.64,19.69 v40.64,15.24
  Bottom 0.203: v27.43,27.18 27.84,27.59 27.84,33.67 31.05,36.89 33.27,36.89 33.78,37.39 33.78,38.35 33.02,39.12 31.75,39.12 31.24,39.62 31.24,40.89 32.51,42.16 40.39,42.16 41.91,43.69 ISP2_EXT.P$5 | U$6.P$1 v40.64,15.24
MOSI_LED  (via drill 0.35)
  Top 0.203: v45.72,38.1 MOSI.C
  Bottom 0.203: v45.72,38.1 41.42,38.1 38.43,35.11 33.02,35.11 32.62,34.71 U$5.28
N$1
  Top 0.203: BOARD_POWER.A R1.2
N$2
  Top 0.203: STATUS.A R2.2
N$3  (via drill 0.35)
  Top 0.203: v50.04,50.8 TX0.A
  Bottom 0.203: v50.04,50.8 R4.2
N$4  (via drill 0.35)
  Top 0.203: v50.04,48.26 RX0.A
  Bottom 0.203: R5.2 v50.04,48.26
N$5  (via drill 0.35)
  Top 0.203: v50.04,27.94 TX1.A
  Bottom 0.203: R6.2 v50.04,27.94
N$6  (via drill 0.35)
  Top 0.203: RX1.A v50.04,25.4
  Bottom 0.203: v50.04,25.4 R7.2
N$7  (via drill 0.35)
  Top 0.203: SDA.A v50.04,43.18
  Bottom 0.203: v50.04,43.18 R8.2
N$8
  Top 0.203: USER.A R3.2
N$9
  Bottom 0.203: P0.P$1 P1.P$1 P2.P$1
N$10
  Bottom 0.203: P0.P$2 P1.P$2 P2.P$2
N$11
  Bottom 0.203: P0.P$3 59.44,46.99 P1.P$3 P2.P$3
N$12
  Bottom 0.203: P0.P$4 P1.P$4 P2.P$4
N$13
  Bottom 0.203: P0.P$5 P1.P$5 P2.P$5
N$14  (via drill 0.35)
  Top 0.203: MISO.A v50.04,40.64
  Bottom 0.203: v50.04,40.64 R9.2
N$15  (via drill 0.35)
  Top 0.203: v50.04,38.1 MOSI.A
  Bottom 0.203: R10.2 v50.04,38.1
N$16
  Bottom 0.203: P2.P$6 P1.P$6 P0.P$6
N$17
  Bottom 0.203: P0.P$7 P1.P$7 P2.P$7
N$18
  Bottom 0.203: P2.P$8 P1.P$8 P0.P$8
N$19
  Bottom 0.203: P0.P$9 P1.P$9 P2.P$9
N$20
  Bottom 0.203: P2.P$10 P1.P$10 P0.P$10
N$21
  Bottom 0.203: P0.P$11 P1.P$11 P2.P$11
N$22
  Bottom 0.203: P0.P$12 P1.P$12 P2.P$12
N$23
  Bottom 0.203: P2.P$13 P1.P$13 P0.P$13
N$24
  Bottom 0.203: P0.P$14 P1.P$14 P2.P$14
N$25
  Bottom 0.203: P2.P$15 P1.P$15 P0.P$15
N$26
  Bottom 0.203: P0.P$16 P1.P$16 P2.P$16
N$27
  Bottom 0.203: P2.P$17 P1.P$17 P0.P$17
N$28
  Bottom 0.203: P0.P$18 P1.P$18 P2.P$18
N$29
  Bottom 0.203: P2.P$19 P1.P$19 P0.P$19
N$30
  Bottom 0.203: P0.P$20 P1.P$20 P2.P$20
N$31
  Bottom 0.203: P3.P$1 P4.P$1 P5.P$1
N$32
  Bottom 0.203: P5.P$2 P4.P$2 P3.P$2
N$33
  Bottom 0.203: P3.P$3 P4.P$3 P5.P$3
N$34
  Bottom 0.203: P5.P$4 P4.P$4 P3.P$4
N$35
  Bottom 0.203: P3.P$5 P4.P$5 P5.P$5
N$36
  Bottom 0.203: P5.P$6 P4.P$6 P3.P$6
N$37
  Bottom 0.203: P3.P$7 P4.P$7 P5.P$7
N$38
  Bottom 0.203: P5.P$8 P4.P$8 P3.P$8
N$39
  Bottom 0.203: P3.P$9 P4.P$9 P5.P$9
N$40
  Bottom 0.203: P5.P$10 P4.P$10 P3.P$10
N$41
  Bottom 0.203: P3.P$11 P4.P$11 P5.P$11
N$42
  Bottom 0.203: P3.P$12 P4.P$12 P5.P$12
N$43
  Bottom 0.203: P5.P$13 P4.P$13 P3.P$13
N$44
  Bottom 0.203: P3.P$14 P4.P$14 P5.P$14
N$45
  Bottom 0.203: P5.P$15 P4.P$15 P3.P$15
N$46
  Bottom 0.203: P3.P$16 P4.P$16 P5.P$16
N$47
  Bottom 0.203: P5.P$17 P4.P$17 P3.P$17
N$48
  Bottom 0.203: P3.P$18 P4.P$18 P5.P$18
N$49
  Bottom 0.203: P5.P$19 P4.P$19 P3.P$19
N$50
  Bottom 0.203: P3.P$20 P4.P$20 P5.P$20
N$52
  Top 0.203: AVR_POWER1.A R13.2
OC0A  (via drill 0.35)
  Top 0.203: U$1.43 34.44,21.59 35.05,20.98 U$3.P$46 35.05,19.3 36.07,18.29 36.07,14.99 35.33,14.25 19.33,14.25 18.87,13.79 v18.87,10.41
  Bottom 0.203: EXT0.P$15 52.32,16.51 51.82,17.02 51.82,20.07 50.73,21.15 35.63,21.15 35.05,20.57 U$3.P$46 | v18.87,10.41 18.77,10.32 6.6,10.32 6.35,10.57 DRAGON.P$4
OC0B  (via drill 0.35)
  Top 0.203: U$1.44 35.24,21.65 36.58,20.32 36.58,19.3 37.59,18.29 U$3.P$47 37.59,16.01 35.23,13.64 | 35.23,13.64 25.17,13.64 v25.15,13.62 | EXT0.P$16 53.01,13.64 35.23,13.64
  Bottom 0.203: DRAGON.P$5 7.37,13.97 7.87,14.48 24.29,14.48 v25.15,13.62
OC1A  (via drill 0.35)
  Top 0.203: U$1.14 33.64,35.93 34.54,36.83 35.81,36.83 36.32,37.34 36.32,39.88 | 36.32,39.88 35.81,40.39 U$3.P$15 | DRAGON.P$19 7.11,49.53 7.52,49.94 7.52,51.7 9.26,53.44 21.75,53.44 25.82,49.38 43.79,49.38 47.86,53.44 54.51,53.44 55.37,52.58 55.37,43.18 | v56.13,10.67 55.63,10.67 55.37,10.92 55.37,43.18 | v54.36,43.45 52.58,43.45 50.79,41.66 37.07,41.66 36.32,40.9 36.32,39.88 | 55.37,43.18 55.63,43.43 v56.13,43.43
  Bottom 0.203: EXT0.P$17 54.1,11.43 54.86,10.67 v56.13,10.67 | v54.36,43.45 56.12,43.45 v56.13,43.43
OC1B
  Top 0.203: DRAGON.P$18 7.37,46.99 7.87,47.5 7.87,51.56 9.4,53.09 21.61,53.09 25.67,49.02 43.94,49.02 48.01,53.09 54.36,53.09 55.02,52.43 55.02,43.18 | U$3.P$14 37.59,37.08 36.98,36.47 36.07,36.47 | U$1.13 34.44,36.12 34.8,36.47 36.07,36.47 | EXT0.P$18 54.36,8.89 55.02,9.55 55.02,43.18 | 55.02,43.18 54.65,42.82 52.46,42.82 50.94,41.29 37.22,41.29 36.68,40.76 36.68,37.08 36.07,36.47
OC2A  (via drill 0.35)
  Top 0.203: U$1.16 32.04,35.85 33.53,37.34 33.53,39.88 33.02,40.39 U$3.P$17 | EXT1.P$7 77.98,36.83 76.71,35.56 68.33,35.56 v67.82,35.05 67.82,33.53 67.56,33.27 61.47,33.27 v61.21,33.53 | v67.82,9.65 68.33,10.16 76.71,10.16 77.98,11.43 EXT1.P$17 | v39.29,40.02 41.02,40.02 47.77,33.27 54.1,33.27 v54.36,33.53
  Bottom 0.203: v67.82,35.05 v67.82,9.65 | EXT1.P$7 77.98,36.83 77.17,37.64 77.17,52.76 75.77,54.15 47.56,54.15 43.49,50.09 26.11,50.09 22.04,54.15 6.91,54.15 4.83,52.07 DRAGON.P$21 | v39.29,40.02 38.73,39.47 33.93,39.47 33.02,40.39 U$3.P$17 | v61.21,33.53 60.96,33.27 54.61,33.27 v54.36,33.53
OC2B  (via drill 0.35)
  Top 0.203: U$3.P$16 34.54,37.85 32.84,36.14 U$1.15 | v39.29,39.12 41.43,39.12 47.78,32.77 54.1,32.77 v54.36,32.51 | EXT1.P$18 77.98,8.89 76.71,7.62 69.09,7.62 v68.58,7.11 | EXT1.P$8 77.98,34.29 76.71,33.02 68.83,33.02 v68.58,32.77 61.47,32.77 v61.21,32.51
  Bottom 0.203: v68.58,32.77 v68.58,7.11 | EXT1.P$8 77.98,34.29 76.71,35.56 76.71,52.57 75.48,53.8 47.71,53.8 43.64,49.73 25.96,49.73 21.89,53.8 9.1,53.8 7.38,52.07 DRAGON.P$20 | v54.36,32.51 54.61,32.77 60.96,32.77 v61.21,32.51 | U$3.P$16 35.05,38.35 35.81,39.12 v39.29,39.12
RX0  (via drill 0.35)
  Top 0.203: v8.89,39.12 9.41,39.12 9.92,39.62 20.32,39.62 28.58,31.36 U$1.9 40.5,31.36 41.91,32.77 U$3.P$9 | EXT0.P$2 53.34,50.55 53.09,50.8 v51.05,50.8
  Bottom 0.203: v51.05,50.8 51.61,50.24 51.61,38.03 46.35,32.77 U$3.P$9 41.9,32.77 40.63,31.5 39.87,31.5 38.13,29.76 U$5.2 | DRAGON.P$14 7.37,36.83 8.89,38.35 v8.89,39.12
RX0_LED  (via drill 0.35)
  Top 0.203: v45.53,45.24 45.75,45.24 46.23,45.72 46.23,48.01 46.48,48.26 RX0.C
  Bottom 0.203: U$5.25 30.22,35.05 31.35,36.17 37.99,36.17 43.43,41.62 43.43,44.72 44.18,45.47 45.3,45.47 v45.53,45.24
RX1  (via drill 0.35)
  Top 0.203: 39.37,33.78 38.61,33.02 37.11,33.02 U$1.11 | 39.37,33.78 41.66,33.78 | 41.66,33.78 42.67,34.8 U$3.P$11 | EXT0.P$12 52.32,24.13 51.82,24.64 51.82,27.72 45.76,33.78 41.66,33.78 | 39.37,33.78 36.07,33.78 v35.81,33.53
  Bottom 0.203: DRAGON.P$16 7.11,41.91 7.87,42.67 7.87,51.56 9.4,53.09 21.59,53.09 25.65,49.02 43.94,49.02 48.01,53.09 50.55,53.09 51.97,51.67 51.97,24.74 52.58,24.13 EXT0.P$12 | U$5.32 35.56,32.31 35.56,33.27 v35.81,33.53
RX1_LED  (via drill 0.35)
  Top 0.203: v44.45,30.99 45.47,30.99 46.3,30.15 46.3,26.09 46.99,25.4 RX1.C
  Bottom 0.203: U$5.8 38.55,24.96 39.8,26.21 40.69,26.21 41.6,27.12 41.6,30.68 42.16,31.24 44.2,31.24 v44.45,30.99
SCK_88  (via drill 0.35)
  Top 0.203: ISP1_DRAGON.P$2 9.91,34.29 9.4,33.78 v9.4,29.97
  Bottom 0.203: ISP2_EXT.P$2 40.89,46.99 39.22,48.67 23.77,48.67 22.61,47.5 22.61,39.73 18.44,35.56 13.46,35.56 12.19,34.29 ISP1_DRAGON.P$2 | U$5.17 24.72,24.96 23.74,23.98 9.54,23.98 8.99,24.53 8.99,29.57 v9.4,29.97
SCK_1284  (via drill 0.35)
  Top 0.203: U$3.P$3 42.67,24.38 42.42,24.13 39.62,24.13 39.06,24.69 39.06,25.34 37.84,26.56 U$1.3 | EXT0.P$7 53.34,36.07 52.07,34.8 49.78,34.8 v49.53,35.05
  Bottom 0.203: v49.53,35.05 49.53,34.41 44.25,29.13 44.25,26.08 43.31,25.15 U$3.P$3 41.92,25.15 40.51,23.73 39.86,23.73 38.35,22.22 24.25,22.22 23.16,21.14 10.87,21.14 10.42,21.59 DRAGON.P$8
SCL  (via drill 0.35)
  Top 0.203: R11.1 EXT0.P$13 | DRAGON.P$22 4.57,49.53 4.93,49.89 4.93,52.51 6.57,54.15 22.05,54.15 26.11,50.09 43.5,50.09 47.56,54.15 57.61,54.15 58.54,53.21 58.54,48.24 | U$1.19 29.64,35.74 29.97,36.07 U$3.P$20 | EXT0.P$3 51.82,46.99 51.31,46.48 51.31,43.18 50.49,42.37 27.13,42.37 v26.67,41.91 | v58.93,22.61 58.54,22.99 58.54,48.24 | v58.93,48.01 58.78,48.01 58.54,48.24
  Bottom 0.203: v58.93,48.01 56.64,48.01 55.63,46.99 EXT0.P$3 | v58.93,22.61 56.64,22.61 55.63,21.59 EXT0.P$13 | U$3.P$20 29.21,37.85 27.94,39.12 27.03,39.12 26.52,39.62 26.52,41.76 v26.67,41.91
SDA  (via drill 0.35)
  Top 0.203: EXT0.P$14 R12.1 | DRAGON.P$23 4.83,46.99 5.28,47.45 5.28,52.36 6.72,53.8 21.9,53.8 25.96,49.73 43.65,49.73 47.71,53.8 57.46,53.8 58.17,53.09 58.17,45.72 | v33.78,33.48 29.01,33.48 28.84,33.64 U$1.20 28.84,38.21 27.43,39.62 U$3.P$21 27.43,41.66 27.79,42.01 50.64,42.01 51.66,43.03 51.66,44.04 52.07,44.45 EXT0.P$4 | v57.91,20.07 58.17,20.32 58.17,45.72 | v57.91,45.47 58.17,45.72
  Bottom 0.203: v33.78,33.48 34.22,33.03 U$5.30 | v57.91,45.47 56.64,45.47 55.63,44.45 EXT0.P$4 | v57.91,20.07 56.64,20.07 55.63,19.05 EXT0.P$14
SDA_LED  (via drill 0.35)
  Top 0.203: v45.72,43.18 SDA.C
  Bottom 0.203: U$5.26 31.02,35.09 31.75,35.82 38.14,35.82 45.5,43.18 v45.72,43.18
STATUS_LED  (via drill 0.35)
  Top 0.203: U$1.41 32.84,21.34 32.51,21.01 U$3.P$44 32.51,19.3 34.03,17.79 34.03,15.49 v33.78,15.24 | STATUS.C 22.86,5.08 21.59,6.35 | DRAGON.P$2 21.59,6.35 | 21.59,6.35 33.02,6.35 v33.53,6.86
  Bottom 0.203: v33.53,6.86 33.12,7.26 33.12,14.58 v33.78,15.24
SW0
  Top 0.203: S1.1 9.78,2.92 9.65,2.79 3.3,2.79 2.79,3.3 2.79,13.46 3.3,13.97 DRAGON.P$36 4.57,13.97 5.49,14.88 16.41,14.88 17.78,16.26 17.78,21.84 18.54,22.61 U$3.P$35 20.83,22.61 22.1,23.88 22.86,23.88 23.94,24.96 U$1.33
SW1
  Top 0.203: S1.2 12.32,2.92 11.84,2.44 3.15,2.44 2.44,3.16 2.44,15.9 3.05,16.51 DRAGON.P$35 4.83,16.51 6.1,15.24 16.26,15.24 17.42,16.4 17.42,21.99 19.31,23.88 20.32,23.88 21.59,25.15 U$3.P$34 23.12,25.15 23.63,25.65 25.34,25.65 U$1.32
SW2
  Top 0.203: U$1.31 22.24,26.56 20.83,25.15 U$3.P$33 18.8,25.15 18.29,24.64 18.29,23.36 17.07,22.14 17.07,16.55 16.11,15.6 8.79,15.6 6.86,17.53 5.83,17.53 4.31,19.05 DRAGON.P$34 2.79,19.05 2.03,18.29 2.03,3.06 3.01,2.08 14.53,2.08 14.86,2.41 S1.3
SW3
  Top 0.203: S1.4 17.4,2.16 16.97,1.73 2.86,1.73 1.68,2.91 1.68,20.22 3.05,21.59 DRAGON.P$33 4.57,21.59 5.19,20.97 5.19,18.67 5.98,17.88 7.01,17.88 8.12,16.76 8.13,16.76 8.94,15.95 15.97,15.95 16.71,16.7 16.71,22.29 17.93,23.51 17.93,25.3 19.05,26.42 20.07,26.42 21.34,27.69 U$3.P$32 23.62,27.69 23.95,27.36 U$1.30
TCK
  Top 0.203: DRAGON.P$24 3.81,45.21 4.32,45.72 6.6,45.72 8.23,47.35 8.23,51.41 8.89,52.07 JTAG1.P$1 12.45,52.07 13.06,51.45 13.06,46.37 13.35,46.08 23.98,46.08 24.13,46.23 JTAG2.P$1 | U$3.P$22 27.43,37.08 28.04,36.47 U$1.21
  Bottom 0.203: U$3.P$22 26.67,37.85 25.4,39.12 23.62,39.12 22.96,39.78 22.96,46.58 23.37,46.99 JTAG2.P$1
TDI
  Top 0.203: U$3.P$26 23.37,35.31 23.88,34.8 23.88,33.27 | 23.88,33.27 23.88,32.77 24.49,32.16 U$1.24 | DRAGON.P$27 3.81,37.59 3.96,37.74 | 23.88,33.27 23.87,33.27 23.01,34.14 19.15,34.14 18.85,34.44 18.85,35.39 15.32,38.91 10.22,38.91 9.04,37.74 3.96,37.74 | 3.96,37.74 4.83,38.61 4.83,39.89 5.83,40.89 8.13,40.89 9.14,41.91 JTAG1.P$5 12.19,41.91 12.22,41.94 12.22,41.95 13.71,43.43 32.51,43.43 33.02,43.94 33.02,46.48 33.53,46.99 JTAG2.P$5
TDO  (via drill 0.35)
  Top 0.203: U$1.23 24.45,32.96 24.38,33.02 24.38,35.05 22.86,36.58 | v7.62,38.37 9.17,38.37 10.07,39.27 20.17,39.27 22.86,36.58 | DRAGON.P$26 3.81,40.39 2.79,41.4 2.79,42.67 3.4,43.28 7.22,43.28 8.79,44.85 8.79,48.92 9.4,49.53 JTAG1.P$2 12.2,49.53 12.71,49.02 12.71,46.23 13.21,45.73 26.17,45.73 26.67,46.23 JTAG2.P$2 | U$3.P$25 19.81,36.07 20.32,36.58 22.86,36.58
  Bottom 0.203: DRAGON.P$26 3.81,38.61 4.32,38.1 7.35,38.1 v7.62,38.37
TMS  (via drill 0.35)
  Top 0.203: U$1.22 27.24,36.51 26.16,37.59 26.16,39.88 25.65,40.39 U$3.P$23 | DRAGON.P$25 3.81,42.67 4.06,42.93 7.37,42.93 9.14,44.7 9.14,46.48 9.65,46.99 JTAG1.P$3 | v13.97,48.26 14.02,48.31 28.65,48.31 29.21,47.75 JTAG2.P$3
  Bottom 0.203: JTAG1.P$3 12.19,46.99 13.46,48.26 v13.97,48.26 | U$3.P$23 24.89,41.4 25.4,41.91 25.4,47.75 25.91,48.26 28.7,48.26 29.21,47.75 JTAG2.P$3
TOSC1  (via drill 0.35)
  Top 0.203: U$1.25 24.64,31.36 23.42,32.58 23.42,33.22 22.86,33.78 20.32,33.78 | U$3.P$27 19.81,33.27 20.32,33.78 | DRAGON.P$28 3.81,35.31 4.43,35.92 7.73,35.92 10.36,38.56 15.18,38.56 18.49,35.24 18.49,34.29 19,33.78 20.32,33.78 | v21.53,12.34 22.15,12.95 54.1,12.95 v54.36,13.21 | EXT1.P$15 77.98,16.51 76.71,15.24 66.8,15.24 v66.29,14.73 66.29,13.46 65.79,12.95 61.47,12.95 v61.21,13.21 | EXT1.P$5 77.98,41.91 76.71,40.64 66.8,40.64 v66.29,40.13
  Bottom 0.203: v66.29,40.13 v66.29,14.73 | DRAGON.P$28 3.05,34.29 2.44,33.68 2.44,13.3 3.05,12.69 21.18,12.69 v21.53,12.34 | v54.36,13.21 54.61,12.95 60.96,12.95 v61.21,13.21
TOSC2  (via drill 0.35)
  Top 0.203: U$1.26 24.31,30.56 23.11,31.75 | DRAGON.P$29 4.57,31.75 4.98,32.16 4.98,34.95 5.59,35.57 7.88,35.57 10.48,38.17 15.06,38.17 18.14,35.09 18.14,32.96 19.35,31.75 23.11,31.75 | v24.38,12.32 24.52,12.45 54.09,12.45 v54.36,12.19 | EXT1.P$16 77.98,13.97 76.71,12.7 67.31,12.7 v67.06,12.45 61.47,12.45 v61.21,12.19 | EXT1.P$6 77.98,39.37 76.71,38.1 67.56,38.1 v67.06,37.59 | 23.11,31.75 22.35,32.51 U$3.P$28
  Bottom 0.203: v67.06,37.59 v67.06,12.45 | v54.36,12.19 54.61,12.45 60.96,12.45 v61.21,12.19 | DRAGON.P$29 3.3,31.75 2.79,31.24 2.79,13.46 3.21,13.05 23.66,13.05 v24.38,12.32
TX0  (via drill 0.35)
  Top 0.203: DRAGON.P$15 8,39.37 8.61,39.98 20.46,39.98 28.29,32.16 U$1.10 38.76,32.16 39.37,32.77 U$3.P$10 | v50.8,48.77 51.31,48.26 54.1,48.26 54.61,48.77 54.61,51.56 54.1,52.07 EXT0.P$1
  Bottom 0.203: v50.8,48.77 51.26,48.31 51.26,38.18 46.91,33.83 42.21,33.83 41.15,32.77 U$3.P$10 39.37,32.77 38.86,32.26 38.86,30.99 38.43,30.56 U$5.1
TX0_LED  (via drill 0.35)
  Top 0.203: TX0.C 46.33,50.8 45.82,50.29 45.82,46.43 v45.54,46.15
  Bottom 0.203: U$5.24 28.73,34.06 31.2,36.53 37.84,36.53 43.08,41.77 43.08,44.87 44.19,45.97 45.36,45.97 v45.54,46.15
TX1  (via drill 0.35)
  Top 0.203: U$3.P$13 38.1,40.39 38.65,39.83 38.65,37.39 38.09,36.83 | v34.8,33.48 35.24,33.92 U$1.12 35.24,35.75 35.61,36.12 37.38,36.12 38.09,36.83 | 38.09,36.83 43.21,36.83 52.17,27.87 52.17,27.08 52.58,26.67 EXT0.P$11
  Bottom 0.203: DRAGON.P$17 7.11,44.45 7.52,44.86 7.52,51.71 9.25,53.44 21.74,53.44 25.81,49.38 43.79,49.38 47.85,53.44 50.7,53.44 52.32,51.82 52.32,26.92 52.58,26.67 EXT0.P$11 | v34.8,33.48 35.02,33.25 U$5.31
TX1_LED  (via drill 0.35)
  Top 0.203: TX1.C 46.99,27.94 46.66,28.27 46.66,31.06 45.97,31.75 v45.21,31.75
  Bottom 0.203: v45.21,31.75 41.78,31.75 41.25,31.22 41.25,27.27 40.54,26.56 39.65,26.56 38.84,25.76 U$5.7
USER_LED  (via drill 0.35)
  Top 0.203: 21.59,3.81 32,3.81 v32.51,4.32 | USER.C 22.86,2.54 21.59,3.81 | DRAGON.P$1 7.62,3.81 8.13,4.32 8.13,5.33 8.79,5.99 19.41,5.99 21.59,3.81 | v32.77,15.24 32.51,15.49 U$3.P$43 32.51,18.29 31.6,19.2 31.6,20.44 32.04,20.88 U$1.40
  Bottom 0.203: v32.51,4.32 32.77,4.57 v32.77,15.24
VCC  (via drill 0.35)
  Top 0.203: 55.88,2.54 76.71,2.54 77.98,3.81 EXT1.P$20 | 55.88,2.54 35.05,2.54 | R12.2 R11.2 46.65,22.26 47.24,22.86 v48.01,22.86 54.15,22.86 54.66,23.37 54.66,28.65 54.1,29.21 EXT0.P$10 | R2.1 34.29,5.08 35.05,4.32 | JP1.P$2 27.18,8.89 | 27.18,8.89 U$4.P$3 U$4.P$2 U$4.P$1 | R3.1 35.05,2.54 | 35.05,4.32 35.05,2.54 | 35.05,4.32 35.05,7.14 34.57,7.62 28.45,7.62 27.18,8.89 | 13.46,37.82 13.97,37.31 ISP1_DRAGON.P$6 | 13.46,37.82 10.63,37.82 8.02,35.21 5.74,35.21 5.33,34.8 5.33,29.72 4.83,29.21 DRAGON.P$30 | DRAGON.P$10 6.35,25.91 5.84,25.4 4.32,25.4 3.81,24.89 DRAGON.P$32 3.81,23.32 3.2,22.71 2.13,22.71 1.68,22.25 v1.68,21.44 | 13.46,37.82 14.91,37.82 17.78,34.95 17.78,27.3 v18.03,27.05 | v45.15,48.07 44.55,48.67 31.24,48.67 | 25.52,48.67 31.24,48.67 | C4.+ 50.55,4.06 50.8,3.81 EXT0.P$20 54.61,3.81 55.88,2.54 | EXT1.P$10 77.98,29.21 76.71,27.94 v61.21,27.94 | JTAG1.P$9 14.99,49.53 15.85,48.67 25.52,48.67 | R1.1 23.9,50.29 25.52,48.67 | 31.24,48.67 31.75,48.16 JTAG2.P$4
  Bottom 0.203: U$4.P$1 18.29,8.89 17.21,9.96 5.53,9.96 5.08,10.41 5.08,11.94 4.68,12.34 2.9,12.34 1.68,13.56 v1.68,21.44 | ISP2_EXT.P$6 38.35,44.45 37.08,45.72 31.24,45.72 | EXT1.P$10 77.98,29.21 77.47,28.7 77.47,4.32 77.98,3.81 EXT1.P$20 | R6.1 R7.1 47.16,23.2 47.5,22.86 v48.01,22.86 | R4.1 R5.1 | R5.1 R8.1 R9.1 R10.1 | U$5.20 31.42,27.36 | 33.86,27.36 31.5,27.36 31.42,27.36 | U$5.6 34.66,26.56 33.86,27.36 | v18.03,27.05 18.67,26.42 26.67,26.42 27.33,25.76 U$5.18 29.82,25.76 31.42,27.36 | v45.15,48.07 45.34,48.26 R5.1 | DRAGON.P$30 4.32,29.21 4.83,28.7 4.83,24.38 4.57,24.13 DRAGON.P$32 | v61.21,27.94 55.37,27.94 54.1,29.21 EXT0.P$10 | JTAG1.P$4 11.43,43.69 12.32,42.8 | 12.32,42.8 12.95,42.16 12.95,41.4 13.97,40.39 ISP1_DRAGON.P$6 | 15.24,49.28 15.24,46.48 14.48,45.72 13.46,45.72 12.32,44.58 12.32,42.8 | 15.24,49.28 14.99,49.53 JTAG1.P$9 | U$2.P$1 21.59,48.26 21.08,48.77 15.75,48.77 15.24,49.28 | JTAG2.P$9 27.69,44.45 28.96,45.72 31.24,45.72 | 31.24,45.72 31.75,46.23 JTAG2.P$4 | U$5.4 34.66,28.16 33.86,27.36
VCC_MEGA1284  (via drill 0.35)
  Top 0.203: U$3.P$5 42.67,26.92 42.16,26.42 40.12,26.42 38.38,28.16 U$1.5 26.92,28.16 | U$1.38 30.44,22.06 28.96,20.57 28.96,17.78 | v31.75,15.24 31.75,16.76 30.99,17.53 U$3.P$41 29.21,17.53 28.96,17.78 | U$3.P$29 19.81,30.73 20.32,31.24 22.86,31.24 24.35,29.76 U$1.27 25.48,29.72 26.16,29.72 26.45,30 | 26.92,28.16 U$1.29 23.17,28.16 22.58,28.75 20.37,28.75 19.81,28.19 U$3.P$31 | U$3.P$18 32.51,37.08 31.24,35.81 U$1.17 | v26.72,32 26.45,31.73 26.45,30 | 26.92,28.16 26.45,28.63 26.45,30 | JP1.P$1 31.75,9.65 32.6,10.5 R13.1 | 28.96,17.78 28.96,17.02 28.19,16.26 24.64,16.26 23.52,17.37 23.52,21.49 26.45,24.41 26.45,27.68 26.92,28.16
  Bottom 0.203: v31.75,15.24 32.41,14.58 32.41,10.31 31.75,9.65 JP1.P$1 | v26.72,32 26.72,33.06 31.51,37.85 U$3.P$18
XTAL1  (via drill 0.35)
  Top 0.203: v44.45,14.73 44.45,29.97 43.18,31.24 42.16,31.24 41.15,30.23 U$3.P$8 38.86,30.23 38.53,30.56 U$1.8 34.62,30.56 34.16,30.09 27.3,30.09 v27.18,29.97
  Bottom 0.203: v44.45,14.73 45.11,14.07 45.11,7.26 44.7,6.86 | C1.2 42.67,6.6 42.93,6.86 44.7,6.86 | Q1.2 44.2,6.35 44.7,6.86 | DRAGON.P$13 7.37,34.29 12.71,28.95 26.16,28.95 v27.18,29.97
XTAL2  (via drill 0.35)
  Top 0.203: U$3.P$7 42.67,29.46 42.16,28.96 | 42.16,28.96 39.88,28.96 39.08,29.76 U$1.7 34.58,29.76 33.78,28.96 v27.18,28.96 | 42.16,28.96 43.43,28.96 44.09,28.3 44.09,15.65 v43.69,15.24
  Bottom 0.203: v43.69,15.24 43.69,14.48 44.2,13.97 Q1.1 44.2,9.65 43.94,9.4 42.93,9.4 42.67,9.65 C2.2 | DRAGON.P$12 9.4,31.75 12.55,28.59 26.82,28.59 v27.18,28.96

### Text on the board
Document: DRAGON SHIELD MK2.1 | BOARD POWER | TX0 | TX0 | ADC0 | TCK | TDO | TMS | VCC | TDI | MISO | SCK | RST | RX0 | RX0 | ADC1 | GND | VCC | RST | NC | GND | VCC | MOSI | GND | SCL | ADC2 | SDA | SDA | ADC3 | JTAG | ISP | MISO | MISO | TOSC1 | MOSI | TOSC2 | MOSI | SCK | OC2A | AIN0 | OC2B | GND | GND | VCC | VCC | TX1 | RX1 | TX1 | ADC0 | RX1 | ADC1 | SCL | ADC2 | SDA | ADC3 | OC0A | TOSC1 | RESET | OC0B | TOSC2 | GND | OC1A | OC2A | AVR POWER | PROGRAM | OC1B | OC2B | VCC | MEGA88 | EXTERN | GND | GND | STATUS | USER | VCC | VCC | PA4 | PA5 | PA6 | PA7